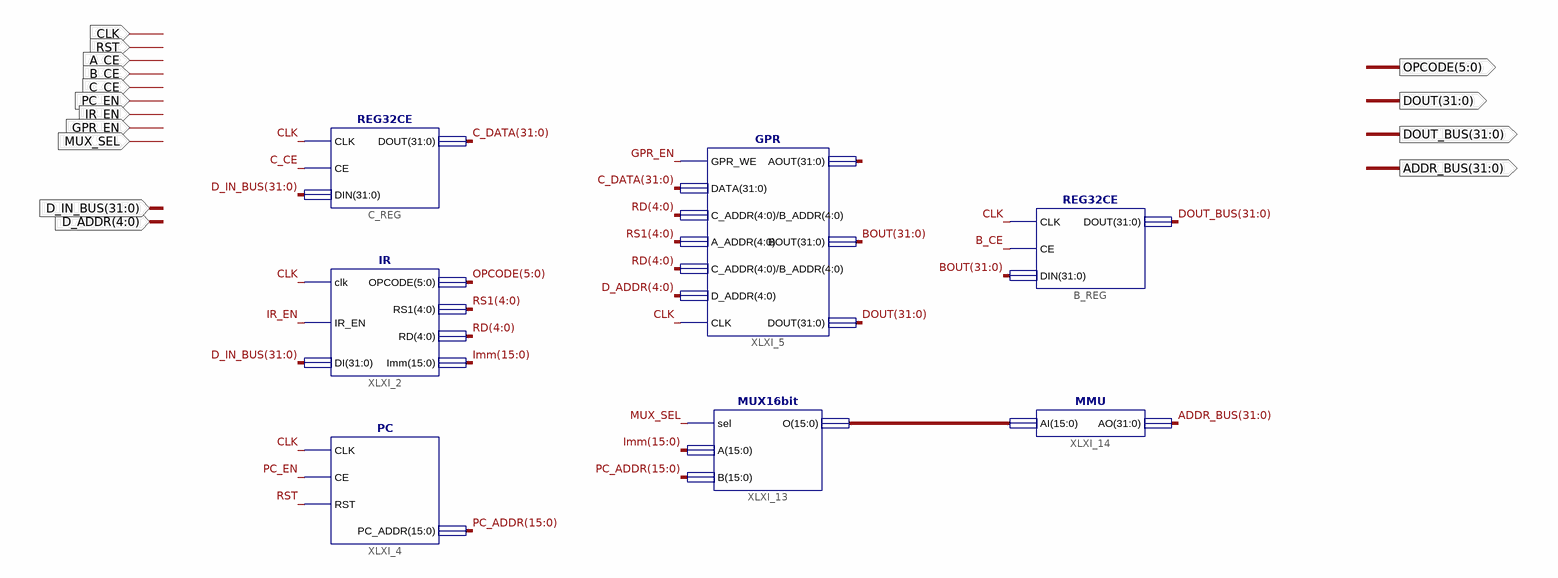
[diagram p0: schematic sheet 1]
// Xilinx ISE schematic DataPath.sch (spartan6) as structural Verilog: 7 symbols, 15 ports
module DataPath (
  input  MUX_SEL,
  input  CLK,
  input  C_CE,
  input  IR_EN,
  input  RST,
  input  B_CE,
  input  A_CE,
  input  PC_EN,
  input  GPR_EN,
  input  [4:0] D_ADDR,
  input  [31:0] D_IN_BUS,
  output [31:0] DOUT,
  output [31:0] DOUT_BUS,
  output [31:0] ADDR_BUS,
  output [5:0] OPCODE
);

  wire [4:0] RD, RS1;
  wire [15:0] Imm, PC_ADDR, XLXN_51;
  wire [31:0] BOUT, C_DATA, XLXN_57;

  REG32CE C_REG (.CLK(CLK), .CE(C_CE), .DIN(D_IN_BUS), .DOUT(C_DATA));
  IR XLXI_2 (.clk(CLK), .IR_EN(IR_EN), .DI(D_IN_BUS), .OPCODE(OPCODE), .RS1(RS1), .RD(RD), .Imm(Imm));
  PC XLXI_4 (.CLK(CLK), .CE(PC_EN), .RST(RST), .PC_ADDR(PC_ADDR));
  GPR XLXI_5 (
    .GPR_WE(GPR_EN), .DATA(C_DATA), .C_ADDR(RD), .A_ADDR(RS1), .B_ADDR(RD), .D_ADDR(D_ADDR), .CLK(CLK),
    .AOUT(XLXN_57), .BOUT(BOUT), .DOUT(DOUT));
  MUX16bit XLXI_13 (.sel(MUX_SEL), .A(Imm), .B(PC_ADDR), .O(XLXN_51));
  REG32CE B_REG (.CLK(CLK), .CE(B_CE), .DIN(BOUT), .DOUT(DOUT_BUS));
  MMU XLXI_14 (.AI(XLXN_51), .AO(ADDR_BUS));
endmodule
